# EAGLE design Power_Socket_nrf24_dil (EAGLE 6.2)
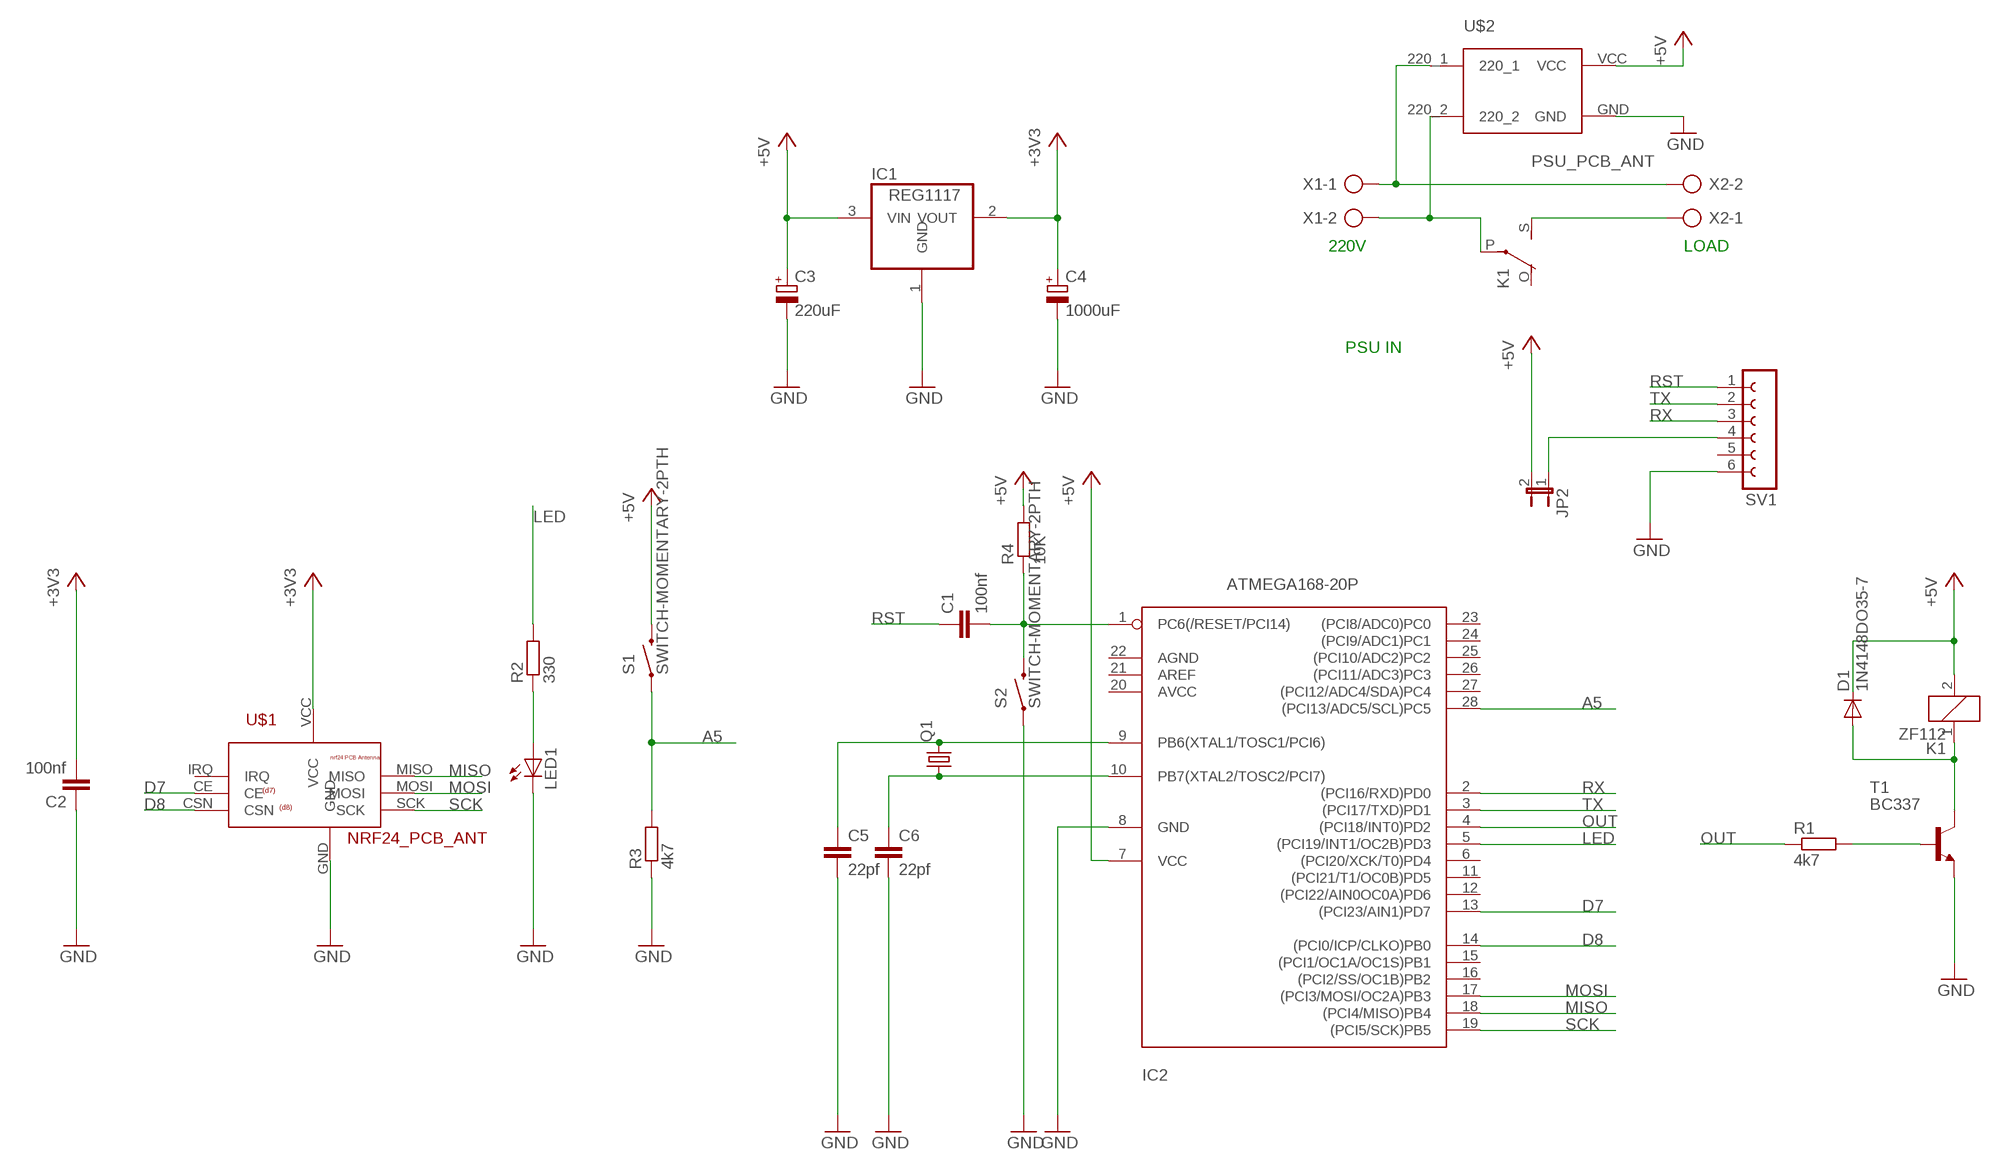
[diagram p0: schematic, sheet 1]

## Parts
C1  100nf  C-EUC1206  [C1206]
C2  100nf  C-EUC1206  [C1206]
C3  220uF  CPOL-EUE2.5-6  [E2,5-6]
C4  1000uF  CPOL-EUE2.5-6  [E2,5-6]
C5  22pf  C-EUC0805K  [C0805K]
C6  22pf  C-EUC0805K  [C0805K]
D1  1N4148DO35-7  [DO35-7]
IC1  REG1117  [SOT223]
IC2  ATMEGA168-20P  [DIL28-3]
JP2  JUMPER-2PTH_LOCK  [1X02_LOCK]
K1  ZF112  [ZF112]
LED1  LED3MM  [LED3MM]
Q1  CRYSTALHC49UV  [HC49U-V]
R1  4k7  R-EU_0207/10  [0207/10]
R2  330  R-EU_0207/10  [0207/10]
R3  4k7  R-EU_0207/10  [0207/10]
R4  10K  R-EU_0207/10  [0207/10]
S1  SWITCH-MOMENTARY-2PTH  [TACTILE-PTH]
S2  SWITCH-MOMENTARY-2PTH  [TACTILE-PTH]
SV1  FE06-1  [FE06]
T1  BC337  [TO92]
U$1  NRF24_PCB_ANT  [NRF24_PCB_ANT]
U$2  PSU_PCB_ANT  [PSU_PCB_600MA]
X1  AK300/2  [AK300/2]
X2  AK300/2  [AK300/2]

## Nets
+3V3: C2.2 C4.+ IC1.2(VOUT) U$1.VCC
+5V: C3.+ D1.C IC1.3(VIN) IC2.7(VCC) JP2.2 K1.2 R4.2 S1.3 U$2.VCC
A5: IC2.28((PCI13/ADC5/SCL)PC5) R3.2 S1.1
D7: IC2.13((PCI23/AIN1)PD7) U$1.CE
D8: IC2.14((PCI0/ICP/CLKO)PB0) U$1.CSN
GND: C2.1 C3.- C4.- C5.2 C6.2 IC1.1(GND) IC2.8(GND) LED1.K(C) R3.1 S2.1 SV1.6 T1.1(E) U$1.GND U$2.GND
LED: IC2.5((PCI19/INT1/OC2B)PD3) R2.2
MISO: IC2.18((PCI4/MISO)PB4) U$1.MISO
MOSI: IC2.17((PCI3/MOSI/OC2A)PB3) U$1.MOSI
N$1: U$2.220_1 X1.1 X2.2
N$2: K1.P(2:P) U$2.220_2 X1.2
N$3: K1.S(2:S) X2.1
N$4: D1.A K1.1 T1.3(C)
N$5: R1.2 T1.2(B)
N$6: JP2.1 SV1.4
N$7: C1.2 IC2.1(PC6(/RESET/PCI14)) R4.1 S2.3
N$8: LED1.A R2.1
N$9: C5.1 IC2.9(PB6(XTAL1/TOSC1/PCI6)) Q1.2
N$10: C6.1 IC2.10(PB7(XTAL2/TOSC2/PCI7)) Q1.1
OUT: IC2.4((PCI18/INT0)PD2) R1.1
RST: C1.1 SV1.1
RX: IC2.2((PCI16/RXD)PD0) SV1.3
SCK: IC2.19((PCI5/SCK)PB5) U$1.SCK
TX: IC2.3((PCI17/TXD)PD1) SV1.2
Unconnected: IC2.6((PCI20/XCK/T0)PD4) IC2.11((PCI21/T1/OC0B)PD5) IC2.12((PCI22/AIN0OC0A)PD6) IC2.15((PCI1/OC1A/OC1S)PB1) IC2.16((PCI2/SS/OC1B)PB2) IC2.20(AVCC) IC2.21(AREF) IC2.22(AGND) IC2.23((PCI8/ADC0)PC0) IC2.24((PCI9/ADC1)PC1) IC2.25((PCI10/ADC2)PC2) IC2.26((PCI11/ADC3)PC3) IC2.27((PCI12/ADC4/SDA)PC4) K1.O(2:O) SV1.5 U$1.IRQ

## Notes on the sheet
- 220V | LOAD
- PSU IN

## Library data of the parts
C1 C2 C5 C6 = resistor:C-EU: CAPACITOR, European symbol
C3 C4 = resistor:CPOL-EU: POLARIZED CAPACITOR, European symbol
D1 = diode:1N4148: DIODE high speed (Philips)
IC1 = burr-brown:REG1117: 800mA and 1A Low Dropout (LDO) Positive Regulator 1.8V, 2.5V, 2.85V, 3.3V, 5V, and Adj; MPN: REG1117; OC_FARNELL: 1097566; OC_NEWARK: 14P6981
IC2 = adafruit:ATMEGA168*P: MICROCONTROLLER 16 kBytes FLASH 1 kBytes SRAM 512 Bytes EEPROM USART 8-channel 10 bit ADC
JP2 = SparkFun:JUMPER-2: Jumper Basic 0.1" spaced jumper. Use with breakaway headers.
K1 = relay:ZF112: RELAY 1 x switch; OC_FARNELL: unknown; OC_NEWARK: unknown
LED1 = led:LED: LED OSRAM: - CHIPLED LG R971, LG N971, LY N971, LG Q971, LY Q971, LO R971, LY R971 LH N974, LH R974 LS Q976, LO Q976, LY Q976 LO Q996 - Hyper CHIPLED LW Q18S LB Q993, LB Q99A, LB R99A - SideLED LS A670, LO A670, LY A670, LG A670, LP A670 LB A673, LV A673, LT A673, LW A673 LH A674 LY A675 LS A676, LA A676, LO A676, LY A676, LW A676 LS A679, LY A679, LG A679 - Hyper Micro SIDELED® LS Y876, LA Y876, LO Y876, LY Y876 LT Y87S - SmartLED LW L88C, LW L88S LB L89C, LB L89S, LG L890 LS L89K, LO L89K, LY L89K LS L896, LA L896, LO L896, LY L896 - TOPLED LS T670, LO T670, LY T670, LG T670, LP T670 LSG T670, LSP T670, LSY T670, LOP T670, LYG T670 LG T671, LOG T671, LSG T671 LB T673, LV T673, LT T673, LW T673 LH T674 LS T676, LA T676, LO T676, LY T676, LB T676, LH T676, LSB T676, LW T676 LB T67C, LV T67C, LT T67C, LS T67K, LO T67K, LY T67K, LW E67C LS E67B, LA E67B, LO E67B, LY E67B, LB E67C, LV E67C, LT E67C LW T67C LS T679, LY T679, LG T679 LS T770, LO T770, LY T770, LG T770, LP T770 LB T773, LV T773, LT T773, LW T773 LH T774 LS E675, LA E675, LY E675, LS T675 LS T776, LA T776, LO T776, LY T776, LB T776 LHGB T686 LT T68C, LB T68C - Hyper Mini TOPLED® LB M676 - Mini TOPLED Santana® LG M470 LS M47K, LO M47K, LY M47K Source: http://www.osram.convergy.de LUXEON: - LUMILED® LXK2-PW12-R00, LXK2-PW12-S00, LXK2-PW14-U00, LXK2-PW14-V00 LXK2-PM12-R00, LXK2-PM12-S00, LXK2-PM14-U00 LXK2-PE12-Q00, LXK2-PE12-R00, LXK2-PE12-S00, LXK2-PE14-T00, LXK2-PE14-U00 LXK2-PB12-K00, LXK2-PB12-L00, LXK2-PB12-M00, LXK2-PB14-N00, LXK2-PB14-P00, LXK2-PB14-Q00 LXK2-PR12-L00, LXK2-PR12-M00, LXK2-PR14-Q00, LXK2-PR14-R00 LXK2-PD12-Q00, LXK2-PD12-R00, LXK2-PD12-S00 LXK2-PH12-R00, LXK2-PH12-S00 LXK2-PL12-P00, LXK2-PL12-Q00, LXK2-PL12-R00 Source: www.luxeon.com KINGBRIGHT: KA-3528ASYC Source: www.kingbright.com
Q1 = SparkFun:CRYSTAL: Crystals Various standard crystals. Proven footprints. Spark Fun Electronics SKU : COM-00534
R1-R4 = resistor:R-EU_: RESISTOR, European symbol
S1 S2 = SparkFun:SWITCH-MOMENTARY-2
SV1 = con-lsta:FE06-1: FEMALE HEADER; OC_FARNELL: unknown; OC_NEWARK: unknown
T1 = transistor:BC337: NPN TRANSISTOR
U$1 = my_components:NRF24_PCB_ANT
U$2 = my_components:PSU_PCB_ANT
X1 X2 = con-ptr500:AK300/2: CONNECTOR; OC_FARNELL: unknown; OC_NEWARK: unknown

## Board
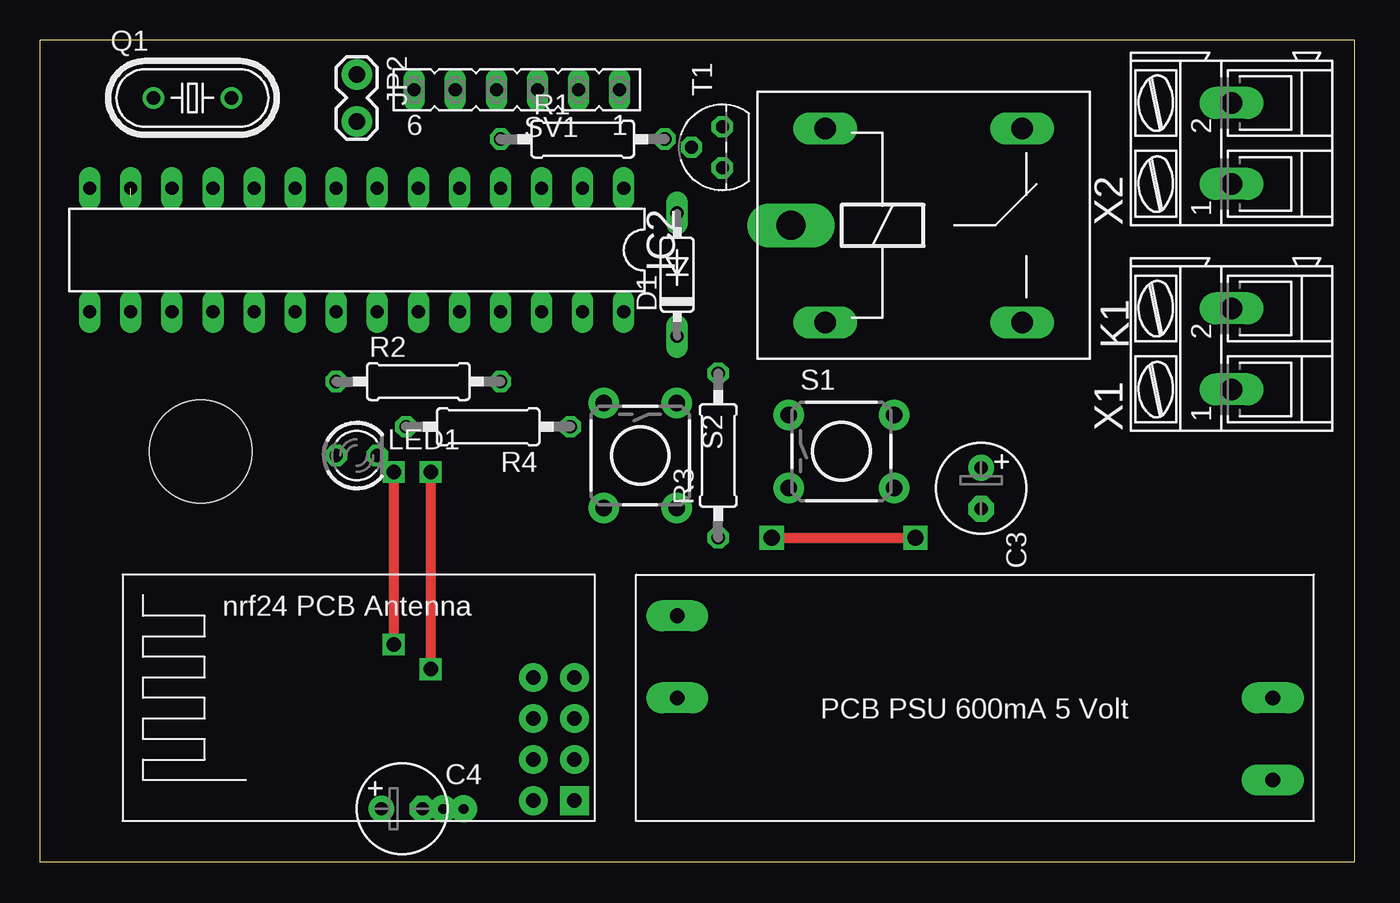
[diagram p1: board, top side]
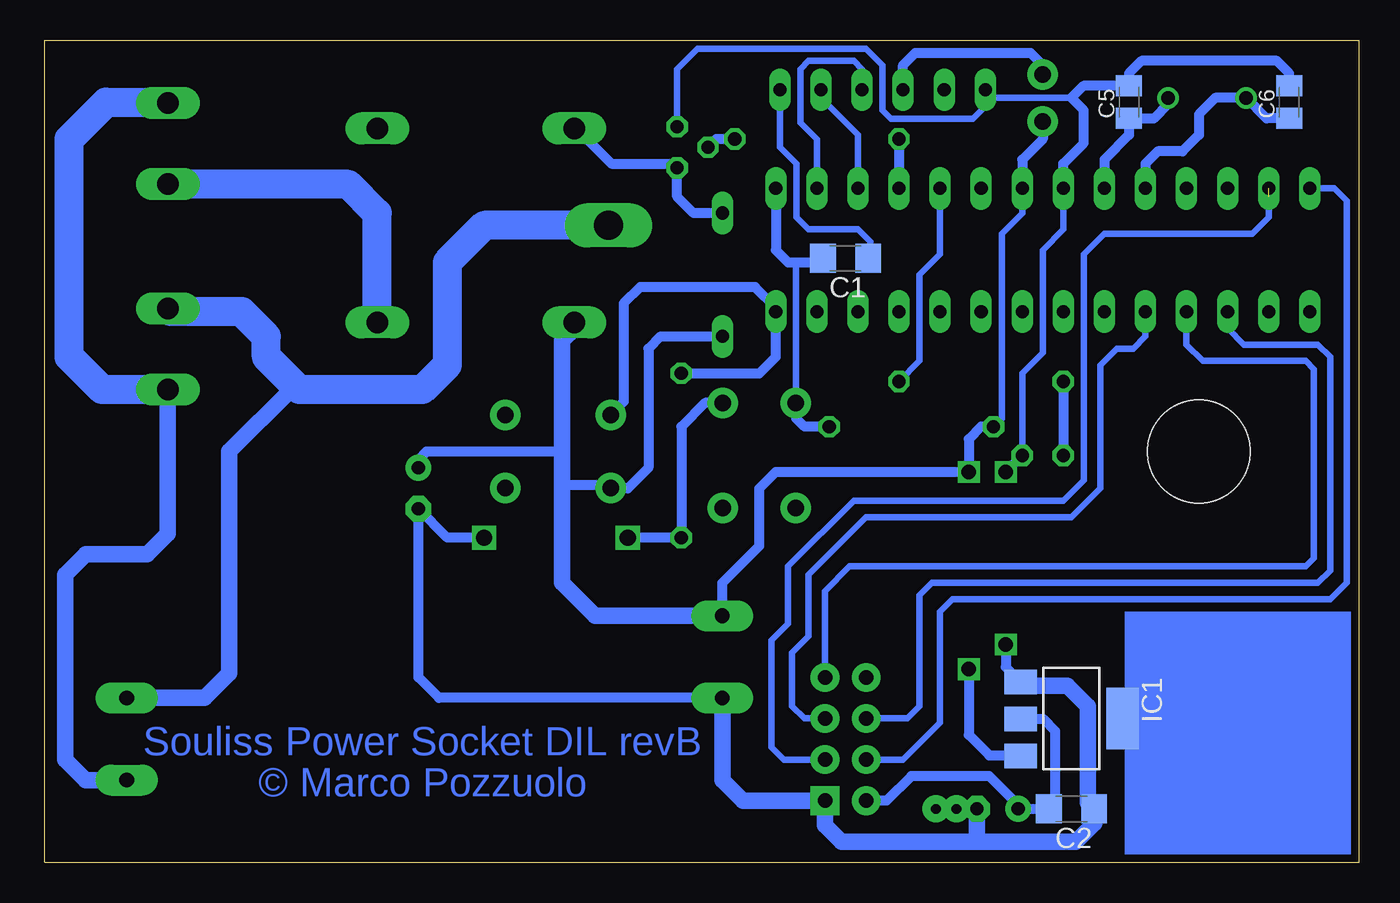
[diagram p2: board, bottom side, seen from below]

Size 81.28 x 50.8 mm. Coordinates in mm from the lower left corner, seen from the top.
Outline: 81.28,0 0,0 0,50.8 81.28,50.8 81.28,0
Copper layers (1*16): Top 0.035mm / dielectric 1.5mm / Bottom 0.035mm
Design rules: minimum track width 10mil, minimum drill 24mil, track to track 8mil, track to pad 8mil, pad to pad 8mil, via to via 8mil, smd to smd 8mil, copper to edge 40mil, drill to drill 8mil, minimum pad ring 10mil, minimum via ring 8mil, stop-mask expansion 4mil, vias tented up to drill 0mil, thermal gap 10mil
Holes 6.35 mm at 9.91,25.4

### Footprints (pad centres in the part's own frame; a part is rotated, then mirrored left to right if it is on the bottom)
C1206 = smd 1.6 x 1.8: 1 -1.4,0; 2 1.4,0
E2,5-6 = drill 0.813 pad 1.6: + -1.27,0 | drill 0.813 pad 1.6 octagon: - 1.27,0
C0805K = smd 1.3 x 1.6: 1 -1,0; 2 1,0
DO35-7 = drill 0.813 long: A 3.81,0; C -3.81,0
SOT223 = smd 1.499 x 2.007: 1 -2.261,-3.15; 2 0.025,-3.15; 3 2.311,-3.15 | smd 3.81 x 2.007: 4 0,3.15
DIL28-3 = drill 0.813 long: 1 -16.51,-3.81; 2 -13.97,-3.81; 3 -11.43,-3.81; 4 -8.89,-3.81; 5 -6.35,-3.81; 6 -3.81,-3.81; 7 -1.27,-3.81; 8 1.27,-3.81; 9 3.81,-3.81; 10 6.35,-3.81; 11 8.89,-3.81; 12 11.43,-3.81; 13 13.97,-3.81; 14 16.51,-3.81; 15 16.51,3.81; 16 13.97,3.81; 17 11.43,3.81; 18 8.89,3.81; 19 6.35,3.81; 20 3.81,3.81; 21 1.27,3.81; 22 -1.27,3.81; 23 -3.81,3.81; 24 -6.35,3.81; 25 -8.89,3.81; 26 -11.43,3.81; 27 -13.97,3.81; 28 -16.51,3.81
1X02_LOCK = drill 1.016 pad 1.88: 1 -0.178,0; 2 2.718,0
ZF112 = drill 1.321 long: 1 -6.096,5.994; 2 -6.096,-5.994; O 6.096,5.994; S 6.096,-5.994 | drill 1.803 long: P -8.204,0
LED3MM = drill 0.813 octagon: A -1.27,0; K 1.27,0
HC49U-V = drill 0.813: 1 -2.413,0; 2 2.413,0
0207/10 = drill 0.813 octagon: 1 -5.08,0; 2 5.08,0
TACTILE-PTH = drill 1.016 pad 1.88: 1 -3.251,2.261; 2 3.251,2.261; 3 -3.251,-2.261; 4 3.251,-2.261
FE06 = drill 0.813 long: 1 -6.35,0; 2 -3.81,0; 3 -1.27,0; 4 1.27,0; 5 3.81,0; 6 6.35,0
TO92 = drill 0.813 octagon: 1 1.27,0; 2 0,1.905; 3 -1.27,0
NRF24_PCB_ANT = drill 0.9 pad 1.778: CE -6.35,1.27; CSN -3.81,1.27; IRQ -3.81,-3.81; MISO -6.35,-3.81; MOSI -3.81,-1.27; SCK -6.35,-1.27; VCC -3.81,3.81 | drill 0.9 pad 1.778 square: GND -6.35,3.81
PSU_PCB_600MA = drill 0.9 pad 1.93 long: 220_1 2.54,2.54; 220_2 7.62,2.54; GND 7.62,39.37; VCC 12.7,39.37
AK300/2 = drill 1.321 long: 1 -2.515,0; 2 2.489,0

### Placement (x,y rotation side)
C1  31.75,37.34 180 bottom
C2  17.78,3.3 180 bottom
C3  58.17,23.11 270 top
C4  22.35,3.3 0 top
C5  14.22,46.99 90 bottom
C6  4.32,46.99 90 bottom
D1  39.37,36.32 90 top
IC1  17.78,8.89 270 bottom
IC2  19.56,37.85 180 top
JP2  19.56,48.51 270 top
K1  54.61,39.37 0 top
LED1  19.56,25.15 0 top
Q1  9.4,47.24 0 top
R1  33.53,44.7 0 top
R2  23.37,29.72 0 top
R3  41.91,25.15 90 top
R4  27.69,26.92 180 top
S1  49.53,25.4 0 top
S2  37.08,25.15 270 top
SV1  29.46,47.75 180 top
T1  42.16,44.2 90 top
U$1  26.67,7.62 180 top
U$2  78.74,2.54 90 top
X1  73.66,31.75 90 top
X2  73.66,44.45 90 top

### Tracks (layer width: path | path; a pad name or v marks a point on that pad's centre or on a via)
+3V3
  Bottom 0.61: IC1.2 19.53,8.87 18.8,8.13 18.8,3.69 C2.2 | 19.69,3.81 C2.2 | C2.2 C4.+ 21.08,3.56 22.86,5.33 27.69,5.33 29.21,3.81 U$1.VCC
+5V  (via drill 0.9)
  Top 0.61: v24.13,24.13 v24.13,11.94
  Bottom 0.406: IC2.7 20.83,40.13 22.1,38.86 22.1,27.43 R4.2
  Bottom 0.61: JP2.2 19.56,44.7 20.83,43.43 IC2.7 | IC1.3 20.95,6.6 22.86,6.6 24.13,7.87 v24.13,11.94 | 23.88,24.38 v24.13,24.13 | R4.2 23.37,26.92 24.13,26.16 v24.13,24.13 | D1.C 43.18,32.51 43.94,31.75 43.94,24.38 45.21,23.11 46.25,23.11 S1.3 46.28,23.32 49.07,23.32 49.28,23.11 | U$2.VCC 39.37,17.27 37.08,19.56 37.08,23.11 36.07,24.13 v24.13,24.13 | C3.+ 58.17,24.89 57.66,25.4 49.53,25.4 49.28,25.15
  Bottom 1.016: U$2.VCC 47.24,15.24 49.28,17.27 49.28,23.11 49.28,25.15 49.28,32.26 48.51,33.02 K1.2
A5
  Bottom 0.61: 46.25,27.69 S1.1 45.47,28.47 45.47,34.54 44.45,35.56 37.34,35.56 36.07,34.29 IC2.28 36.07,31.24 37.08,30.23 R3.2
D7  (1 unrouted)
  Bottom 0.406: U$1.CE 35.56,6.35 36.32,7.11 36.32,13.72 35.31,14.73 35.31,18.29 31.24,22.35 18.29,22.35 17.02,23.62 17.02,37.59 15.75,38.86 6.6,38.86 5.59,39.88 5.59,41.15
D8
  Bottom 0.406: IC2.14 1.52,41.66 0.76,40.89 0.76,17.27 1.78,16.26 25.15,16.26 25.91,15.49 25.91,8.64 28.19,6.35 U$1.CSN
GND  (via drill 0.9, 1)
  Top 0.61: v21.84,24.13 v21.84,13.46 | v45.21,20.07 v54.1,20.07
  Bottom 0.406: T1.1 42.16,49.02 40.89,50.29 30.48,50.29 29.46,49.28 29.46,46.48 28.96,45.97 23.88,45.97 23.11,46.74 23.11,47.24 | 23.11,47.24 SV1.6 | 17.78,47.24 23.11,47.24 | IC2.8 18.29,39.12 19.56,37.85 19.56,31.5 20.83,30.23 LED1.K
  Bottom 0.61: 20.83,11.25 IC1.1 21.84,12.06 v21.84,13.46 | IC2.8 18.29,43.18 17.02,44.45 17.02,46.48 17.78,47.24 17.03,47.99 C5.2 14.22,48.77 13.46,49.53 5.08,49.53 4.32,48.77 C6.2 | LED1.K v21.84,24.13 | 38.1,10.16 U$2.GND 56.9,10.16 58.17,11.43 C3.- 56.39,20.07 v54.1,20.07 | v45.21,20.07 R3.1 41.91,26.92 40.44,28.4 S2.1
  Bottom 1.016: U$2.GND 39.37,5.08 38.1,3.81 U$1.GND 33.02,2.29 32,1.27 23.37,1.27 | 20.9,11.18 IC1.1 20.7,10.92 18.03,10.92 16.76,9.65 16.76,3.69 C2.1 16.38,2.42 17.53,1.27 23.37,1.27 | C4.- 23.62,1.52 23.37,1.27
LED
  Bottom 0.406: IC2.5 25.91,37.59 27.18,36.32 27.18,30.99 R2.2
MISO
  Bottom 0.406: U$1.MISO 33.02,16.76 31.5,18.29 3.3,18.29 2.79,18.8 2.79,30.48 3.3,30.99 9.65,30.99 10.67,32 IC2.18
MOSI
  Bottom 0.406: U$1.MOSI 27.94,8.89 27.18,9.65 27.18,16.51 26.42,17.27 2.54,17.27 1.78,18.03 1.78,31.24 2.54,32 7.11,32 8.13,33.02 IC2.17
N$1
  Bottom 1.016: U$2.220_1 78.74,5.08 80.01,6.35 80.01,17.78 78.74,19.05 74.93,19.05 73.66,20.32 X1.1 73.69,29.21
  Bottom 1.778: 73.69,29.21 77.72,29.21 79.76,31.24 79.76,44.7 77.47,46.99 73.71,46.99 X2.2
N$2
  Bottom 1.016: 65.79,29.46 65.91,29.34 66.04,29.21 69.85,25.4 69.85,11.68 71.37,10.16 U$2.220_2
  Bottom 1.778: K1.P 54.1,39.37 56.39,37.08 56.39,30.73 57.91,29.21 65.53,29.21 65.79,29.46 67.56,31.24 67.56,32.51 69.09,34.04 73.46,34.04 X1.2
N$3
  Bottom 1.778: K1.S 60.71,40.13 62.48,41.91 73.64,41.91 X2.1
N$4
  Bottom 0.61: K1.1 48.41,45.47 48.41,45.36 46.23,43.18 42.42,43.18 T1.3 42.16,41.15 41.15,40.13 D1.A
N$5
  Bottom 0.61: R1.2 39.75,44.7 T1.2
N$6
  Bottom 0.61: SV1.4 28.19,49.28 27.43,50.04 20.32,50.04 19.56,49.28 JP2.1
N$7
  Bottom 0.406: S2.3 34.82,37.06 34.8,37.08
  Bottom 0.61: IC2.1 36.07,37.85 35.31,37.08 34.8,37.08 33.4,37.08 C1.2 | R4.1 34.29,26.92 34.8,27.43 34.8,28.37 S2.3
N$8
  Bottom 0.61: R2.1 LED1.A
N$9
  Bottom 0.61: Q1.2 11.81,46.86 12.7,45.97 14.21,45.97 C5.1 14.22,44.96 15.75,43.43 IC2.9
N$10
  Bottom 0.61: C6.1 5.73,45.99 Q1.1 8.89,47.24 9.91,46.23 9.91,44.96 10.92,43.94 12.45,43.94 13.21,43.18 IC2.10
N$11  (via drill 3.2)
  other vias: 9.91,25.4
N$12  (via drill 0.6 pad 1.68)
  other vias: 26.16,3.3
N$13  (via drill 0.6 pad 1.68)
  other vias: 24.89,3.3
OUT
  Bottom 0.61: R1.1 IC2.4
RST
  Bottom 0.406: SV1.1 35.81,44.2 34.8,43.18 34.8,39.88 34.04,39.12 30.99,39.12 30.23,38.35 30.23,37.46
  Bottom 0.61: 30.23,37.46 C1.1
RX
  Bottom 0.406: SV1.3 30.73,49.02 31.24,49.53 34.04,49.53 34.54,49.02 34.54,45.72 33.53,44.7 IC2.2
SCK
  Bottom 0.406: U$1.SCK 34.29,8.89 35.05,9.65 35.05,12.95 34.04,13.97 34.04,17.78 30.48,21.34 17.78,21.34 16,23.11 16,30.73 14.99,31.75 13.97,31.75 13.21,32.51 IC2.19
TX
  Bottom 0.406: SV1.2 33.27,47.24 30.99,44.96 IC2.3
(copper drawn outside any net)
  shapes: Bottom area x1

### Text on the board
Bottom: Souliss Power Socket DIL revB | © Marco Pozzuolo